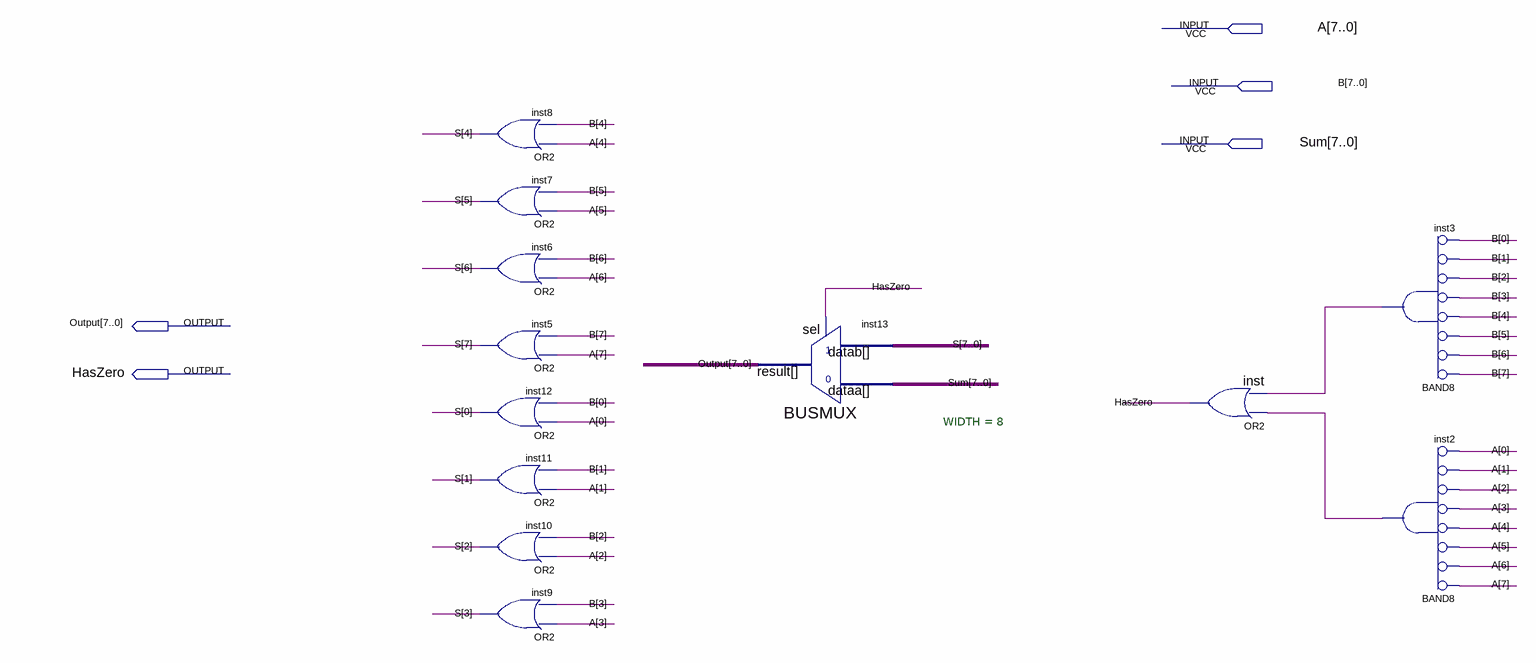
[diagram p0: schematic sheet]
// Quartus schematic CheckZero.bdf as structural Verilog: 12 symbols, 5 pins
module CheckZero (
  input  [7:0] A,
  input  [7:0] B,
  input  [7:0] Sum,
  output [7:0] Output,
  output HasZero
);

  wire inst2_out, inst3_out;
  wire [7:0] S;

  or inst8 (S[4], A[4], B[4]);
  or inst7 (S[5], A[5], B[5]);
  or inst6 (S[6], A[6], B[6]);
  or inst5 (S[7], A[7], B[7]);
  or inst12 (S[0], A[0], B[0]);
  or inst11 (S[1], A[1], B[1]);
  or inst10 (S[2], A[2], B[2]);
  or inst9 (S[3], A[3], B[3]);
  BUSMUX #(.WIDTH(8)) inst13 (.datab(S), .sel(HasZero), .dataa(Sum), .result(Output));
  or inst (HasZero, inst2_out, inst3_out);
  and inst3 (inst3_out, ~B[7], ~B[6], ~B[5], ~B[4], ~B[3], ~B[2], ~B[1], ~B[0]);  // BAND8
  and inst2 (inst2_out, ~A[7], ~A[6], ~A[5], ~A[4], ~A[3], ~A[2], ~A[1], ~A[0]);  // BAND8
endmodule
